# Altium schematic sheet DIO.SchDoc
size A4; SheetNumber: 8; SheetTotal: 15
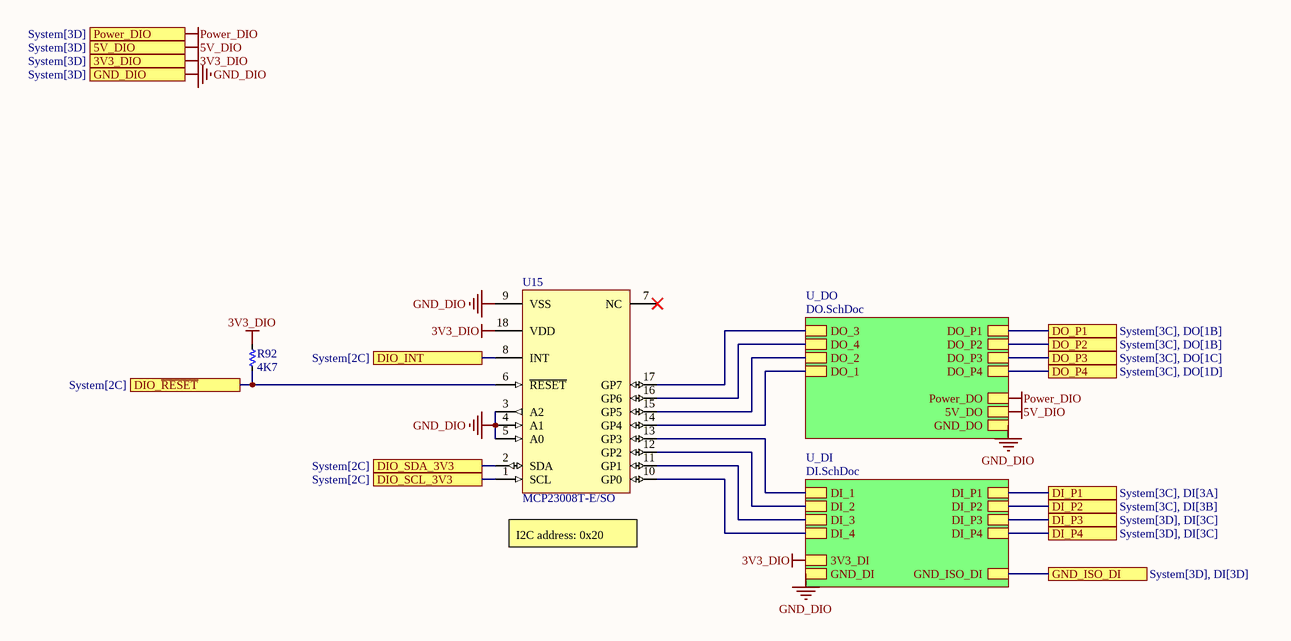
[diagram p0: DIO.SchDoc]

## Parts
R92  4K7  [RES-SMD-0603]
U15  MCP23008T-E/SO  [SOIC-SO18_N]

## Sub-sheets
U_DI = DI.SchDoc: DI_1, DI_2, DI_3, DI_4, 3V3_DI, GND_DI, DI_P1, DI_P3, DI_P4, DI_P2, GND_ISO_DI
U_DO = DO.SchDoc: 5V_DO, GND_DO, Power_DO, DO_4, DO_3, DO_2, DO_1, DO_P4, DO_P1, DO_P3, DO_P2

## Ports
3V3_DIO (see System[3D]), 5V_DIO (see System[3D]), DI_P1 (see System[3C], DI[3A]), DI_P2 (see System[3C], DI[3B]), DI_P3 (see System[3D], DI[3C]), DI_P4 (see System[3D], DI[3C]), DIO_INT (see System[2C]), DIO_SCL_3V3 (see System[2C]), DIO_SDA_3V3 (see System[2C]), DIO_~{RESET} (see System[2C]), DO_P1 (see System[3C], DO[1B]), DO_P2 (see System[3C], DO[1B]), DO_P3 (see System[3C], DO[1C]), DO_P4 (see System[3C], DO[1D]), GND_DIO (see System[3D]), GND_ISO_DI (see System[3D], DI[3D]), Power_DIO (see System[3D])

## Nets
3V3_DIO: R92.2 U15.18(VDD) ; port 3V3_DIO, sheet U_DI/3V3_DI
5V_DIO: port 5V_DIO, sheet U_DO/5V_DO
GND_DIO: U15.3(A2) U15.4(A1) U15.5(A0) U15.9(VSS) ; port GND_DIO, sheet U_DO/GND_DO, sheet U_DI/GND_DI
Power_DIO: port Power_DIO, sheet U_DO/Power_DO
DI_P1: port DI_P1, sheet U_DI/DI_P1
DI_P2: port DI_P2, sheet U_DI/DI_P2
DI_P3: port DI_P3, sheet U_DI/DI_P3
DI_P4: port DI_P4, sheet U_DI/DI_P4
DIO_INT: U15.8(INT) ; port DIO_INT
DIO_~{RESET}: R92.1 U15.6(~{RESET}) ; port DIO_~{RESET}
DIO_SCL_3V3: U15.1(SCL) ; port DIO_SCL_3V3
DIO_SDA_3V3: U15.2(SDA) ; port DIO_SDA_3V3
DO_P1: port DO_P1, sheet U_DO/DO_P1
DO_P2: port DO_P2, sheet U_DO/DO_P2
DO_P3: port DO_P3, sheet U_DO/DO_P3
DO_P4: port DO_P4, sheet U_DO/DO_P4
GND_ISO_DI: port GND_ISO_DI, sheet U_DI/GND_ISO_DI
NetU15_10: U15.10(GP0) ; sheet U_DI/DI_4
NetU15_11: U15.11(GP1) ; sheet U_DI/DI_3
NetU15_12: U15.12(GP2) ; sheet U_DI/DI_2
NetU15_13: U15.13(GP3) ; sheet U_DI/DI_1
NetU15_14: U15.14(GP4) ; sheet U_DO/DO_1
NetU15_15: U15.15(GP5) ; sheet U_DO/DO_2
NetU15_16: U15.16(GP6) ; sheet U_DO/DO_4
NetU15_17: U15.17(GP7) ; sheet U_DO/DO_3

Not connected (* = marked no-connect by the designer): U15 7(NC)*

## Notes on the sheet
- (near U15) I2C address: 0x20

## Library data of the parts
R92 = Res-SMD: Res 0603 5%; Manufacturer: Generic Components; Class: Passive; Published: 08/06/2000; Publisher: Altium Hobart Technology Centre
U15 = CMP-0186-00152-2: 8-Bit I/O Expander with Serial Interface, 18-Pin SOIC, Extended Temperature, Tape and Reel; ComponentLink1Description: Manufacturer URL; ComponentLink3Description: Package Specification; PackageReference: SOIC-SO18; RevisionNote: URLs added.; Code_JEDEC: MS-013; ComponentLink1URL: http://www.microchip.com/; DatasheetVersion: revE, Aug-2007; PackageVersion: revBB, Aug-2009; ComponentLink2URL: http://ww1.microchip.com/downloads/en/DeviceDoc/21919e.pdf; ComponentLink3URL: http://www.microchip.com/stellent/groups/techpub_sg/documents/packagingspec/en012702.pdf; PackageDescription: 18-Lead Plastic Small Outline (SO) - Wide 7.50mm Body [SOIC]; ComponentLink2Description: Datasheet